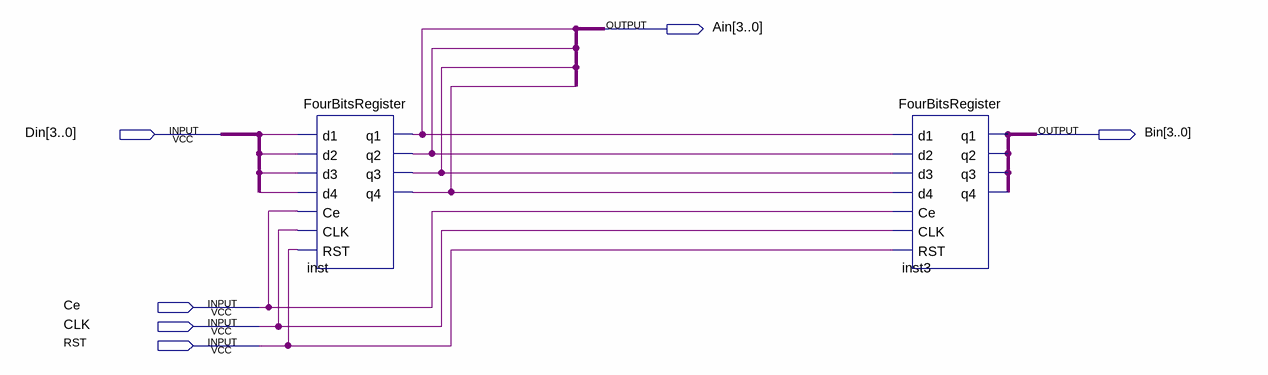
[diagram p0: schematic sheet]
// Quartus schematic DoubleFourBitsRegister.bdf as structural Verilog: 2 symbols, 6 pins
module DoubleFourBitsRegister (
  input  [3:0] Din,
  input  Ce,
  input  CLK,
  input  RST,
  output [3:0] Ain,
  output [3:0] Bin
);

  wire inst_q1, inst_q2, inst_q3, inst_q4, undriven, undriven_2, undriven_3, undriven_4;

  FourBitsRegister inst (
    .d1(undriven_4), .d2(undriven_3), .d3(undriven), .d4(undriven_2), .Ce(Ce), .CLK(CLK), .RST(RST),
    .q1(inst_q1), .q2(inst_q2), .q3(inst_q3), .q4(inst_q4));
  FourBitsRegister inst3 (
    .d1(inst_q1), .d2(inst_q2), .d3(inst_q3), .d4(inst_q4), .Ce(Ce), .CLK(CLK), .RST(RST), .q1(Bin),
    .q2(Bin), .q3(Bin), .q4(Bin));
endmodule
